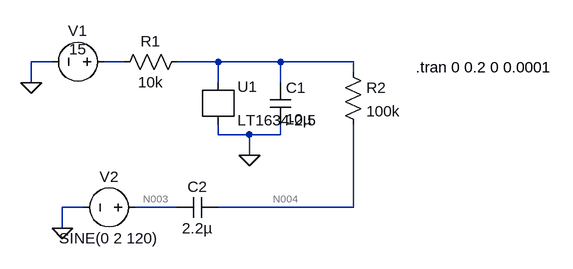
[diagram p0: schematic Draft2.asc]
Draft2.asc, the LTspice schematic file:
Version 4
SHEET 1 880 680
WIRE -160 -32 -192 -32
WIRE -48 -32 -80 -32
WIRE 96 -32 32 -32
WIRE 192 -32 96 -32
WIRE 304 -32 192 -32
WIRE 304 -16 304 -32
WIRE -192 0 -192 -32
WIRE 96 0 96 -32
WIRE 192 0 192 -32
WIRE 96 80 96 64
WIRE 144 80 96 80
WIRE 192 80 192 64
WIRE 192 80 144 80
WIRE 144 112 144 80
WIRE -112 192 -144 192
WIRE 32 192 -32 192
WIRE 304 192 304 64
WIRE 304 192 96 192
WIRE -144 224 -144 192
FLAG -192 0 0
FLAG 144 112 0
FLAG -144 224 0
SYMBOL voltage -64 -32 R90
WINDOW 0 -32 56 VBottom 2
WINDOW 3 -4 56 VBottom 2
WINDOW 123 0 0 Left 2
WINDOW 39 0 0 Left 2
SYMATTR InstName V1
SYMATTR Value 15
SYMBOL res 48 -48 R90
WINDOW 0 0 56 VBottom 2
WINDOW 3 32 56 VTop 2
SYMATTR InstName R1
SYMATTR Value 10k
SYMBOL cap 176 0 R0
SYMATTR InstName C1
SYMATTR Value 10µ
SYMBOL res 288 -32 R0
SYMATTR InstName R2
SYMATTR Value 100k
SYMBOL References\\LT1634-2.5 96 32 R0
SYMATTR InstName U1
SYMBOL voltage -16 192 R90
WINDOW 0 -32 56 VBottom 2
WINDOW 3 32 56 VTop 2
WINDOW 123 0 0 Left 2
WINDOW 39 0 0 Left 2
SYMATTR InstName V2
SYMATTR Value SINE(0 2 120)
SYMBOL cap 96 176 R90
WINDOW 0 0 32 VBottom 2
WINDOW 3 32 32 VTop 2
SYMATTR InstName C2
SYMATTR Value 2.2µ
TEXT 400 -24 Left 2 !.tran 0 0.2 0 0.0001

The netlist it stands for:
* Draft2.asc
V1 N001 0 15
R1 N002 N001 10k
C1 N002 0 10µ
R2 N002 N004 100k
XU1 N002 0 LT1634-2.5
V2 N003 0 SINE(0 2 120)
C2 N004 N003 2.2µ
.tran 0 0.2 0 0.0001
.backanno
.end

* Results of the author's LTspice run, read from the files saved beside the schematic
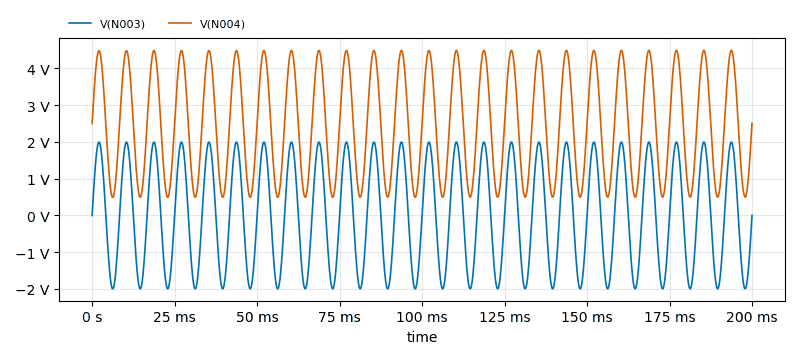
[diagram p1: Transient Analysis of Draft2.asc, plotted from the saved traces]
* Transient Analysis, 1 run:
*   V(N003): min -1.997 V, max 1.997 V, average 0 V, rms 1.412 V, last 0 V
*   V(N004): min 492.2 mV, max 4.493 V, average 2.493 V, rms 2.865 V, last 2.508 V